# Altium schematic sheet SAT_GPS_CLOCK_Input.SchDoc
size A; SheetNumber: 1; SheetTotal: 2
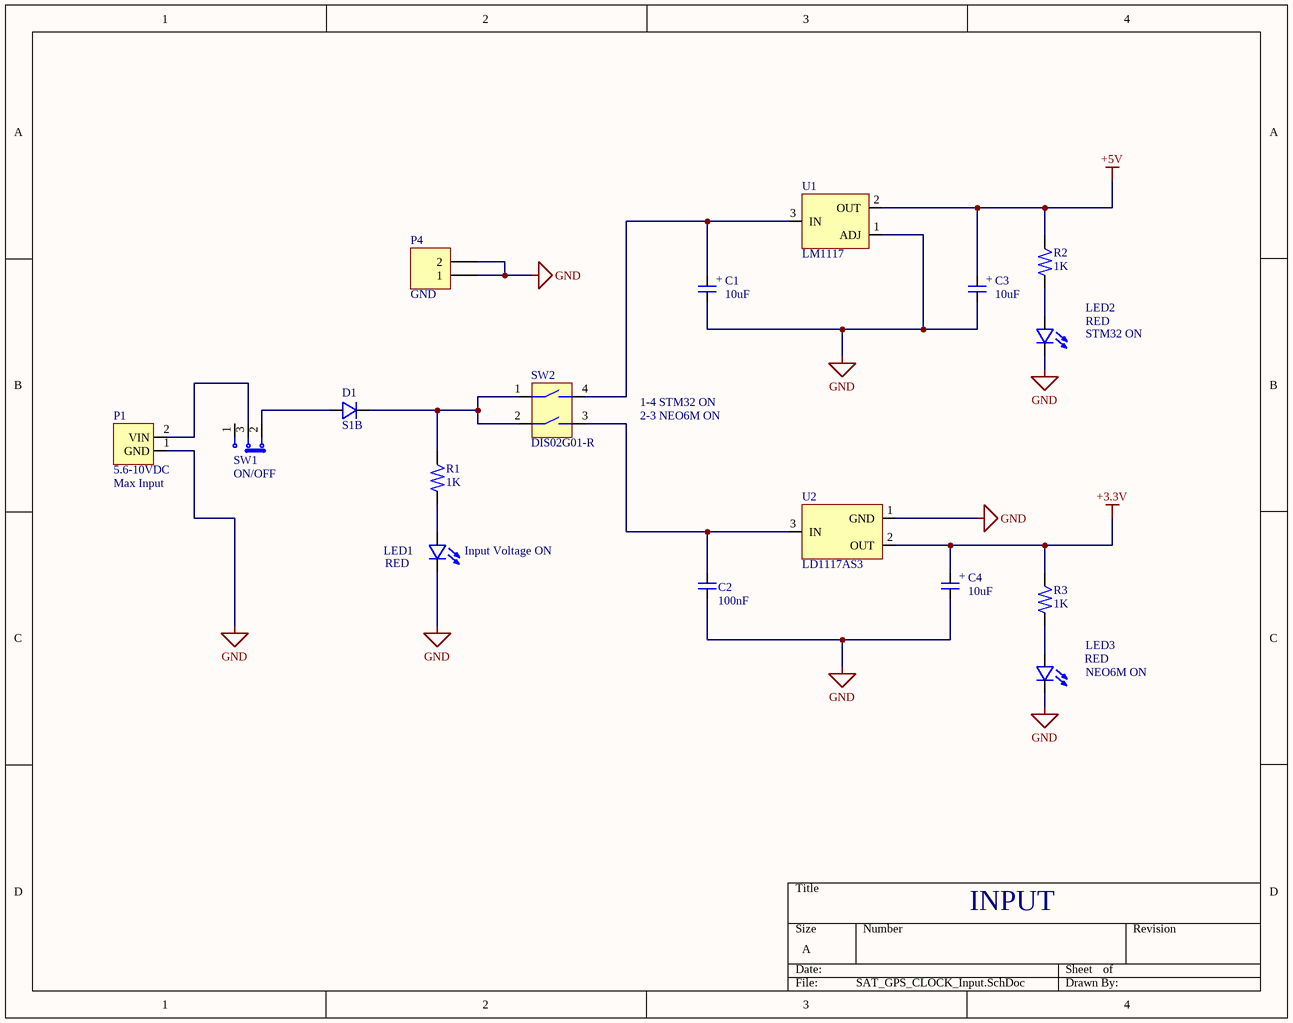
[diagram p0: SAT_GPS_CLOCK_Input.SchDoc]

## Parts
C1  10uF  [SMT_CAP_EL_CHANG_VT1E100MC054000CE0]
C2  100nF  [SMT_CAP_1206(3216)_SAMSUNG]
C3  10uF  [SMT_CAP_EL_CHANG_VT1E100MC054000CE0]
C4  10uF  [SMT_CAP_EL_CHANG_VT1E100MC054000CE0]
D1  S1B  [DIOM4227X23N]
LED1  RED  [DIOM2012X18N]
LED2  RED  [DIOM2012X18N]
LED3  RED  [DIOM2012X18N]
P1  5.6-10VDC  [THT_CON_WAFER_2P_RIGHT-ANGLE_A2010WR0-2P-SW-5E]
P4  GND  [HDR1X2]
R1  1K  [SMT_RES_0805(2012)]
R2  1K  [SMT_RES_0805(2012)]
R3  1K  [SMT_RES_0805(2012)]
SW1  ON/OFF  [THT_SSW_ESP1010]
SW2  DIS02G01-R  [SMT_SWITCH_DIP_DIS02G01-R]
U1  LM1117  [SOT230P700X180-4N]
U2  LD1117AS3  [SMT_VR_LD1117AS3]

## Nets
+3.3V: C4.1 R3.2 U2.2(OUT)
+5V: C3.1 R2.2 U1.2(OUT)
GND: C1.2 C2.1 C3.2 C4.2 LED1.2 LED2.2 LED3.2 P1.1(GND) P4.1 P4.2 U1.1(ADJ) U2.1(GND)
NetC1_1: C1.1 SW2.4 U1.3(IN)
NetC2_2: C2.2 SW2.3 U2.3(IN)
NetD1_1: D1.1 SW1.2
NetD1_2: D1.2 R1.2 SW2.1 SW2.2
NetLED1_1: LED1.1 R1.1
NetLED2_1: LED2.1 R2.1
NetLED3_1: LED3.1 R3.1
NetP1_2: P1.2(VIN) SW1.3

Not connected (* = marked no-connect by the designer): SW1 1

## Notes on the sheet
- (near LED2) STM32 ON
- 2-3 NEO6M ON
- 1-4 STM32 ON
- (near P1) Max Input
- (near LED1) Input Voltage ON
- (near LED3) NEO6M ON
- INPUT
- (in symbol SMT_CAP_EL_CHANG_VT1E100MC054000CE0) +

## Library data of the parts
C1 C3 C4 = SMT_CAP_EL_CHANG_VT1E100MC054000CE0: SMT Capacitor Electrolytic 35V 10uF Pitch 1.3mm VT1E100MC054000CE0
C2 = SMT_CAP_1206(3216)_SAMSUNG: Ceramic Capacitor 1206(3216) Samsung CL31B104KBCNNNC 50VDC
D1 = SMT_DIODE_DO-214AC: Standart Diode DO-214AC 1A
LED1-LED3 = SMT_LED_0805(2012): Led Diode 0805(2012) Cathode Mark, 20mA
P1 = THT_CON_WAFER_2P_RIGHT-ANGLE_A2010WR0-2P-SW-5E: Connector Wafer 2-Pins Pitch-2.0mm Right Angle A2010WR0-2P-SW-5E
P4 = Header 2: Header, 2-Pin; LatestRevisionDate: 17-Jul-2002; LatestRevisionNote: Re-released for DXP Platform.; Publisher: Altium Limited
R1-R3 = SMT_RES_0805(2012): 0805(2012) Resistor 1/4-1/8W 150V 2A
SW1 = THT_SSW_ESP1010: Slide Switch ESP1010 12V 0.5A
SW2 = SMT_SWITCH_DIP_DIS02G01-R: DIP SMD Switch 2-Line 4-Pole 2.54Pitch Rating 25mA/24Vdc Height 0.70mm
U1 = LM1117_SOT-223: LM1117 SOT-223 5V HTC Voltage Regulator
U2 = SMT_VR_LD1117AS3: Voltage Regulator ST LD1117AS33TR 1A 3.3V 10Vmax